# EAGLE schematic Placa principal v81 (EAGLE 9.7.0)
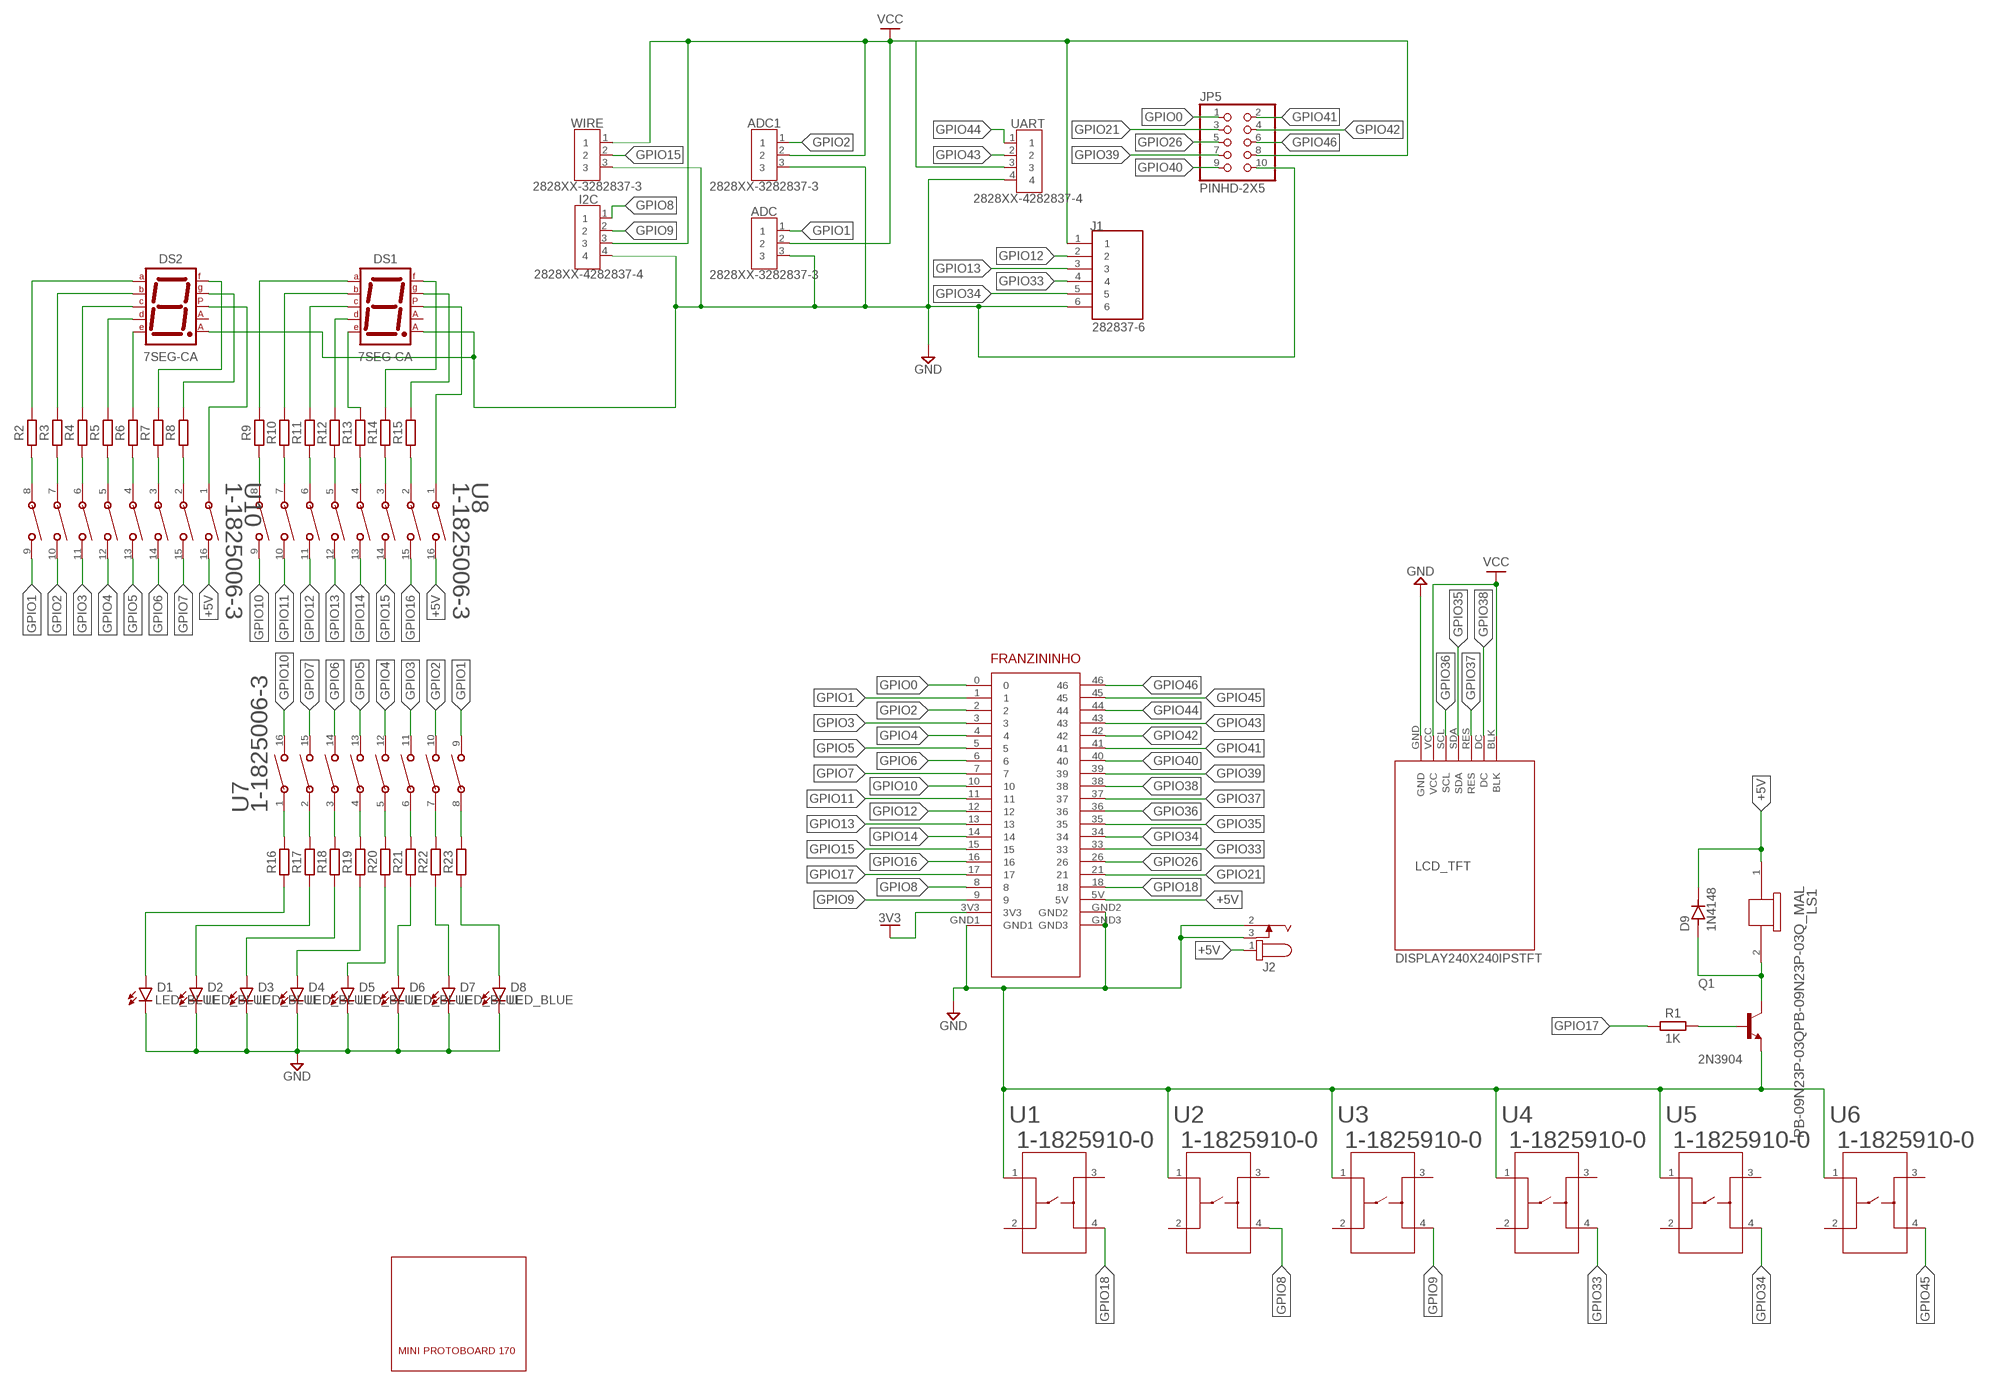
[diagram p0: schematic, sheet 1]

## Parts
ADC  2828XX-3282837-3  [TERMBLK_508-3N]
ADC1  2828XX-3282837-3  [TERMBLK_508-3N]
D1  LED_BLUE  LED_RADIAL_BLUE  [LEDRD254W60D565H860B_B]
D2  LED_BLUE  LED_RADIAL_BLUE  [LEDRD254W60D565H860B_B]
D3  LED_BLUE  LED_RADIAL_BLUE  [LEDRD254W60D565H860B_B]
D4  LED_BLUE  LED_RADIAL_BLUE  [LEDRD254W60D565H860B_B]
D5  LED_BLUE  LED_RADIAL_BLUE  [LEDRD254W60D565H860B_B]
D6  LED_BLUE  LED_RADIAL_BLUE  [LEDRD254W60D565H860B_B]
D7  LED_BLUE  LED_RADIAL_BLUE  [LEDRD254W60D565H860B_B]
D8  LED_BLUE  LED_RADIAL_BLUE  [LEDRD254W60D565H860B_B]
D9  1N4148  [DIOAD829W49L456D191]
DS1  7SEG-CA  [7SEG-13]
DS2  7SEG-CA  [7SEG-13]
I2C  2828XX-4282837-4  [TERMBLK_508-4N]
J1  282837-6  [TE_282837-6]
J2  694106402002  [694106402002]
JP5  PINHD-2X5  [2X05]
LCD_TFT  DISPLAY240X240IPSTFT  [TFT]
LS1  PB-09N23P-03QPB-09N23P-03Q_MAL  [PB-09N23P-03Q_MAL]
Q1  2N3904  [TO92127P495H495-3]
R1  1K  R_AXIAL-7.2MM-PITCH  [RESAD724W46L381D178B]
R2  R_AXIAL-7.2MM-PITCH  [RESAD724W46L381D178B]
R3  R_AXIAL-7.2MM-PITCH  [RESAD724W46L381D178B]
R4  R_AXIAL-7.2MM-PITCH  [RESAD724W46L381D178B]
R5  R_AXIAL-7.2MM-PITCH  [RESAD724W46L381D178B]
R6  R_AXIAL-7.2MM-PITCH  [RESAD724W46L381D178B]
R7  R_AXIAL-7.2MM-PITCH  [RESAD724W46L381D178B]
R8  R_AXIAL-7.2MM-PITCH  [RESAD724W46L381D178B]
R9  R_AXIAL-7.2MM-PITCH  [RESAD724W46L381D178B]
R10  R_AXIAL-7.2MM-PITCH  [RESAD724W46L381D178B]
R11  R_AXIAL-7.2MM-PITCH  [RESAD724W46L381D178B]
R12  R_AXIAL-7.2MM-PITCH  [RESAD724W46L381D178B]
R13  R_AXIAL-7.2MM-PITCH  [RESAD724W46L381D178B]
R14  R_AXIAL-7.2MM-PITCH  [RESAD724W46L381D178B]
R15  R_AXIAL-7.2MM-PITCH  [RESAD724W46L381D178B]
R16  R_AXIAL-7.2MM-PITCH  [RESAD724W46L381D178B]
R17  R_AXIAL-7.2MM-PITCH  [RESAD724W46L381D178B]
R18  R_AXIAL-7.2MM-PITCH  [RESAD724W46L381D178B]
R19  R_AXIAL-7.2MM-PITCH  [RESAD724W46L381D178B]
R20  R_AXIAL-7.2MM-PITCH  [RESAD724W46L381D178B]
R21  R_AXIAL-7.2MM-PITCH  [RESAD724W46L381D178B]
R22  R_AXIAL-7.2MM-PITCH  [RESAD724W46L381D178B]
R23  R_AXIAL-7.2MM-PITCH  [RESAD724W46L381D178B]
U1  1-1825910-0  [SWITCH_1-1825910-0]
U2  1-1825910-0  [SWITCH_1-1825910-0]
U3  1-1825910-0  [SWITCH_1-1825910-0]
U4  1-1825910-0  [SWITCH_1-1825910-0]
U5  1-1825910-0  [SWITCH_1-1825910-0]
U6  1-1825910-0  [SWITCH_1-1825910-0]
U7  1-1825006-3  [SWDIP16_299X110P100]
U8  1-1825006-3  [SWDIP16_299X110P100]
U10  1-1825006-3  [SWDIP16_299X110P100]
U$1  FRANZININHO  [FRANZININHO]
U$3  MINIPROTOBOARD  [MINIPROTOBOARD]
UART  2828XX-4282837-4  [TERMBLK_508-4N]
WIRE  2828XX-3282837-3  [TERMBLK_508-3N]

## Nets
3V3: U$1.3V3
+5V: D9.C J2.1 LS1.1 U8.16 U10.16 U$1.5V
GND: ADC1.3 ADC.3 D1.2(C) D2.2(C) D3.2(C) D4.2(C) D5.2(C) D6.2(C) D7.2(C) D8.2(C) DS1.8(CA2) DS2.8(CA2) I2C.4 J1.6 J2.2 J2.3 JP5.10 LCD_TFT.GND Q1.1(E) U1.1 U2.1 U3.1 U4.1 U5.1 U6.1 U$1.GND1 U$1.GND2 U$1.GND3 UART.4 WIRE.3
GPIO0: JP5.1 U$1.0
GPIO1: ADC.1 U7.9 U10.9 U$1.1
GPIO2: ADC1.1 U7.10 U10.10 U$1.2
GPIO3: U7.11 U10.11 U$1.3
GPIO4: U7.12 U10.12 U$1.4
GPIO5: U7.13 U10.13 U$1.5
GPIO6: U7.14 U10.14 U$1.6
GPIO7: U7.15 U10.15 U$1.7
GPIO8: I2C.1 U2.4 U$1.8
GPIO9: I2C.2 U3.4 U$1.9
GPIO10: U7.16 U8.9 U$1.10
GPIO11: U8.10 U$1.11
GPIO12: J1.2 U8.11 U$1.12
GPIO13: J1.3 U8.12 U$1.13
GPIO14: U8.13 U$1.14
GPIO15: U8.14 U$1.15 WIRE.2
GPIO16: U8.15 U$1.16
GPIO17: R1.1 U$1.17
GPIO18: U1.4 U$1.18
GPIO21: JP5.3 U$1.21
GPIO26: JP5.5 U$1.26
GPIO33: J1.4 U4.4 U$1.33
GPIO34: J1.5 U5.4 U$1.34
GPIO35: LCD_TFT.SDA U$1.35
GPIO36: LCD_TFT.SCL U$1.36
GPIO37: LCD_TFT.RES U$1.37
GPIO38: LCD_TFT.DC U$1.38
GPIO39: JP5.7 U$1.39
GPIO40: JP5.9 U$1.40
GPIO41: JP5.2 U$1.41
GPIO42: JP5.4 U$1.42
GPIO43: U$1.43 UART.2
GPIO44: U$1.44 UART.1
GPIO45: U6.4 U$1.45
GPIO46: JP5.6 U$1.46
N$1: D9.A LS1.2 Q1.3(C)
N$2: DS2.1(E) R6.2
N$3: Q1.2(B) R1.2
N$4: R2.1 U10.8
N$5: R3.1 U10.7
N$6: R4.1 U10.6
N$7: R5.1 U10.5
N$8: R6.1 U10.4
N$9: R7.1 U10.3
N$10: R9.1 U8.8
N$11: R10.1 U8.7
N$12: R11.1 U8.6
N$13: R12.1 U8.5
N$14: R13.1 U8.4
N$15: R14.1 U8.3
N$16: R15.1 U8.2
N$17: R16.2 U7.1
N$18: R17.2 U7.2
N$19: R18.2 U7.3
N$20: R19.2 U7.4
N$21: DS1.7(A) R9.2
N$22: R20.2 U7.5
N$23: DS1.6(B) R10.2
N$24: DS1.4(C) R11.2
N$25: DS1.2(D) R12.2
N$26: DS1.1(E) R13.2
N$27: DS1.9(F) R14.2
N$28: DS1.10(G) R15.2
N$29: DS1.5(DP) U8.1
N$30: DS2.7(A) R2.2
N$31: DS2.6(B) R3.2
N$32: DS2.4(C) R4.2
N$33: DS2.2(D) R5.2
N$34: R8.1 U10.2
N$35: DS2.9(F) R7.2
N$36: DS2.10(G) R8.2
N$37: DS2.5(DP) U10.1
N$38: D1.1(A) R16.1
N$39: D2.1(A) R17.1
N$40: D3.1(A) R18.1
N$41: D4.1(A) R19.1
N$42: D5.1(A) R20.1
N$43: D6.1(A) R21.1
N$44: D7.1(A) R22.1
N$45: D8.1(A) R23.1
N$46: R21.2 U7.6
N$47: R22.2 U7.7
N$48: R23.2 U7.8
VCC: ADC1.2 ADC.2 I2C.3 J1.1 JP5.8 LCD_TFT.BLK LCD_TFT.VCC UART.3 WIRE.1
Unconnected: DS1.3(CA1) DS2.3(CA1) U1.2 U1.3 U2.2 U2.3 U3.2 U3.3 U4.2 U4.3 U5.2 U5.3 U6.2 U6.3

## Library data of the parts
ADC ADC1 WIRE = Connector:2828XX-3: 3 Position Wire to Board Terminal Block Horizontal with Board Datasheet <https://www.te.com.cn/commerce/DocumentDelivery/DDEController?Action=showdoc&DocId=Catalog+Section%7F1308389_EUROSTYLE_TERMINAL_BLOCKS%7F0607%7Fpdf%7FEnglish%7FENG_CS_1308389_EUROSTYLE_TERMINAL_BLOCKS_0607.pdf%7F2-282837-5>; CATEGORY: Connector; DESCRIPTION: TERM BLK 3P SIDE ENT 5.08mm PCB; MANUFACTURER: TE Connectivity; MPN: 282837-3; OPERATING_TEMPERATURE: -40°C to +105°C; PART_STATUS: Active; ROHS_COMPLIANCE: RoHS Compliant; SERIES: 282837; SUBCATEGORY: Terminal Block; TYPE: Side Wire Entry
D1-D8 = Opto-Electronic:LED_RADIAL: LED - Generic; CATEGORY: Opto-Electronic; SUB-CATEGORY: LED
D9 = 1N4148:1N4148: Small Signal Fast Switching Diodes; AVAILABILITY: Unavailable; DESCRIPTION: Diode Small Signal Switching 100V 0.3A 2-Pin DO-35; MF: MICROSS/On Semiconductor; MP: 1N4148; PACKAGE: DO-35 Vishay; PRICE: None; STANDARD: IPC-7251
DS1 DS2 = Opto-Electronic:7SEG-CA: 7-segment DISPLAY single anode, 13 mm; CATEGORY: Opto-Electronic; SUB-CATEGORY: Display; TYPE: 7-Segment
I2C UART = Connector:2828XX-4: 4 Position Wire to Board Terminal Block Horizontal with Board Datasheet <https://www.te.com.cn/commerce/DocumentDelivery/DDEController?Action=showdoc&DocId=Catalog+Section%7F1308389_EUROSTYLE_TERMINAL_BLOCKS%7F0607%7Fpdf%7FEnglish%7FENG_CS_1308389_EUROSTYLE_TERMINAL_BLOCKS_0607.pdf%7F2-282837-5>; CATEGORY: Connector; DESCRIPTION: TERM BLK 4P SIDE ENT 5.08mm PCB; MANUFACTURER: TE Connectivity; MPN: 282837-4; OPERATING_TEMPERATURE: 40°C to +105°C; PART_STATUS: Active; ROHS_COMPLIANCE: RoHS Compliant; SERIES: 283737; SUBCATEGORY: Terminal Block; TYPE: Side Wire Entry
J1 = 282837-6:282837-6; COMMENT: 282837-6; EU_ROHS_COMPLIANCE: Compliant with Exemptions
J2 = Connector:694106402002: DC POWER JACK - VERTICAL - THT - 2.0 & 2.5Ø - WR-DC Details see: Datasheet <https://katalog.we-online.com/en/em/DC_THT_VERTICAL_6_4_69410X402002>; CATEGORY: Connector; DESCRIPTION: DC POWER JACK - VERTICAL - THT - 2.0 & 2.5Ø - WR-DC; MANUFACTURER: Würth Elektronik; MPN: 694106402002; OPERATING_TEMPERATURE: -40°C to +85°C; PART_STATUS: Active; ROHS_COMPLIANCE: RoHS Compliant; SERIES: WR-DC; SUBCATEGORY: Power Connector; TYPE: Vertical
JP5 = Connector:PINHD-2X5: PIN HEADER; CATEGORY: CONNECTOR; SUB-CATEGORY: PIN-HEADER
LCD_TFT = displayLCD:DISPLAY240X240IPSTFT
LS1 = PB-09N23P-03Q_Library:PB-09N23P-03Q; COPYRIGHT: Copyright (C) 2022 Ultra Librarian. All rights reserved.; MANUFACTURER_PART_NUMBER: PB-09N23P-03Q; MFR_NAME: Mallory Sonalert
Q1 = 2N3904:2N3904: 2N3904; MANUFACTURER: STMicroelectronics; MAXIMUM_PACKAGE_HEIGHT: 4.95 mm; PARTREV: February 2003; STANDARD: IPC 7351B
R1-R23 = Resistor:R: Resistor Fixed - Generic; CATEGORY: Resistor; SUB-CATEGORY: Fixed
U1-U6 = Switches:1-1825910-0; BUILT_BY: EMA_UL_Team; CATEGORY: Tactile Switches; COPYRIGHT: Copyright (C) 2016 Accelerated Designs. All rights reserved; DESCRIPTION: FSM6JH=6MM TACT SWITCH, HIGH TEMP; MANUFACTURER_PART_NUMBER: 1-1825910-0; PART_STATUS: active; SERIES: Unknown; VENDOR: TE Connectivity
U7 U8 U10 = Switches:1-1825006-3; BUILT_BY: EMA_UL_Team; CATEGORY: DIP & SIP Switches; COPYRIGHT: Copyright (C) 2016 Accelerated Designs. All rights reserved; DESCRIPTION: GDS0804=DIP SW,SLIDE,THRU/HL; MANUFACTURER_PART_NUMBER: 1-1825006-3; PART_STATUS: active; SERIES: Alcoswitch DIP,Alcoswitch DIP GDS; VENDOR: TE Connectivity
U$1 = Franzininho_Library:FRANZININHO
U$3 = MINIPROTOBOARD:MINIPROTOBOARD